# Altium schematic sheet TrainingBoard.SchDoc
size A3
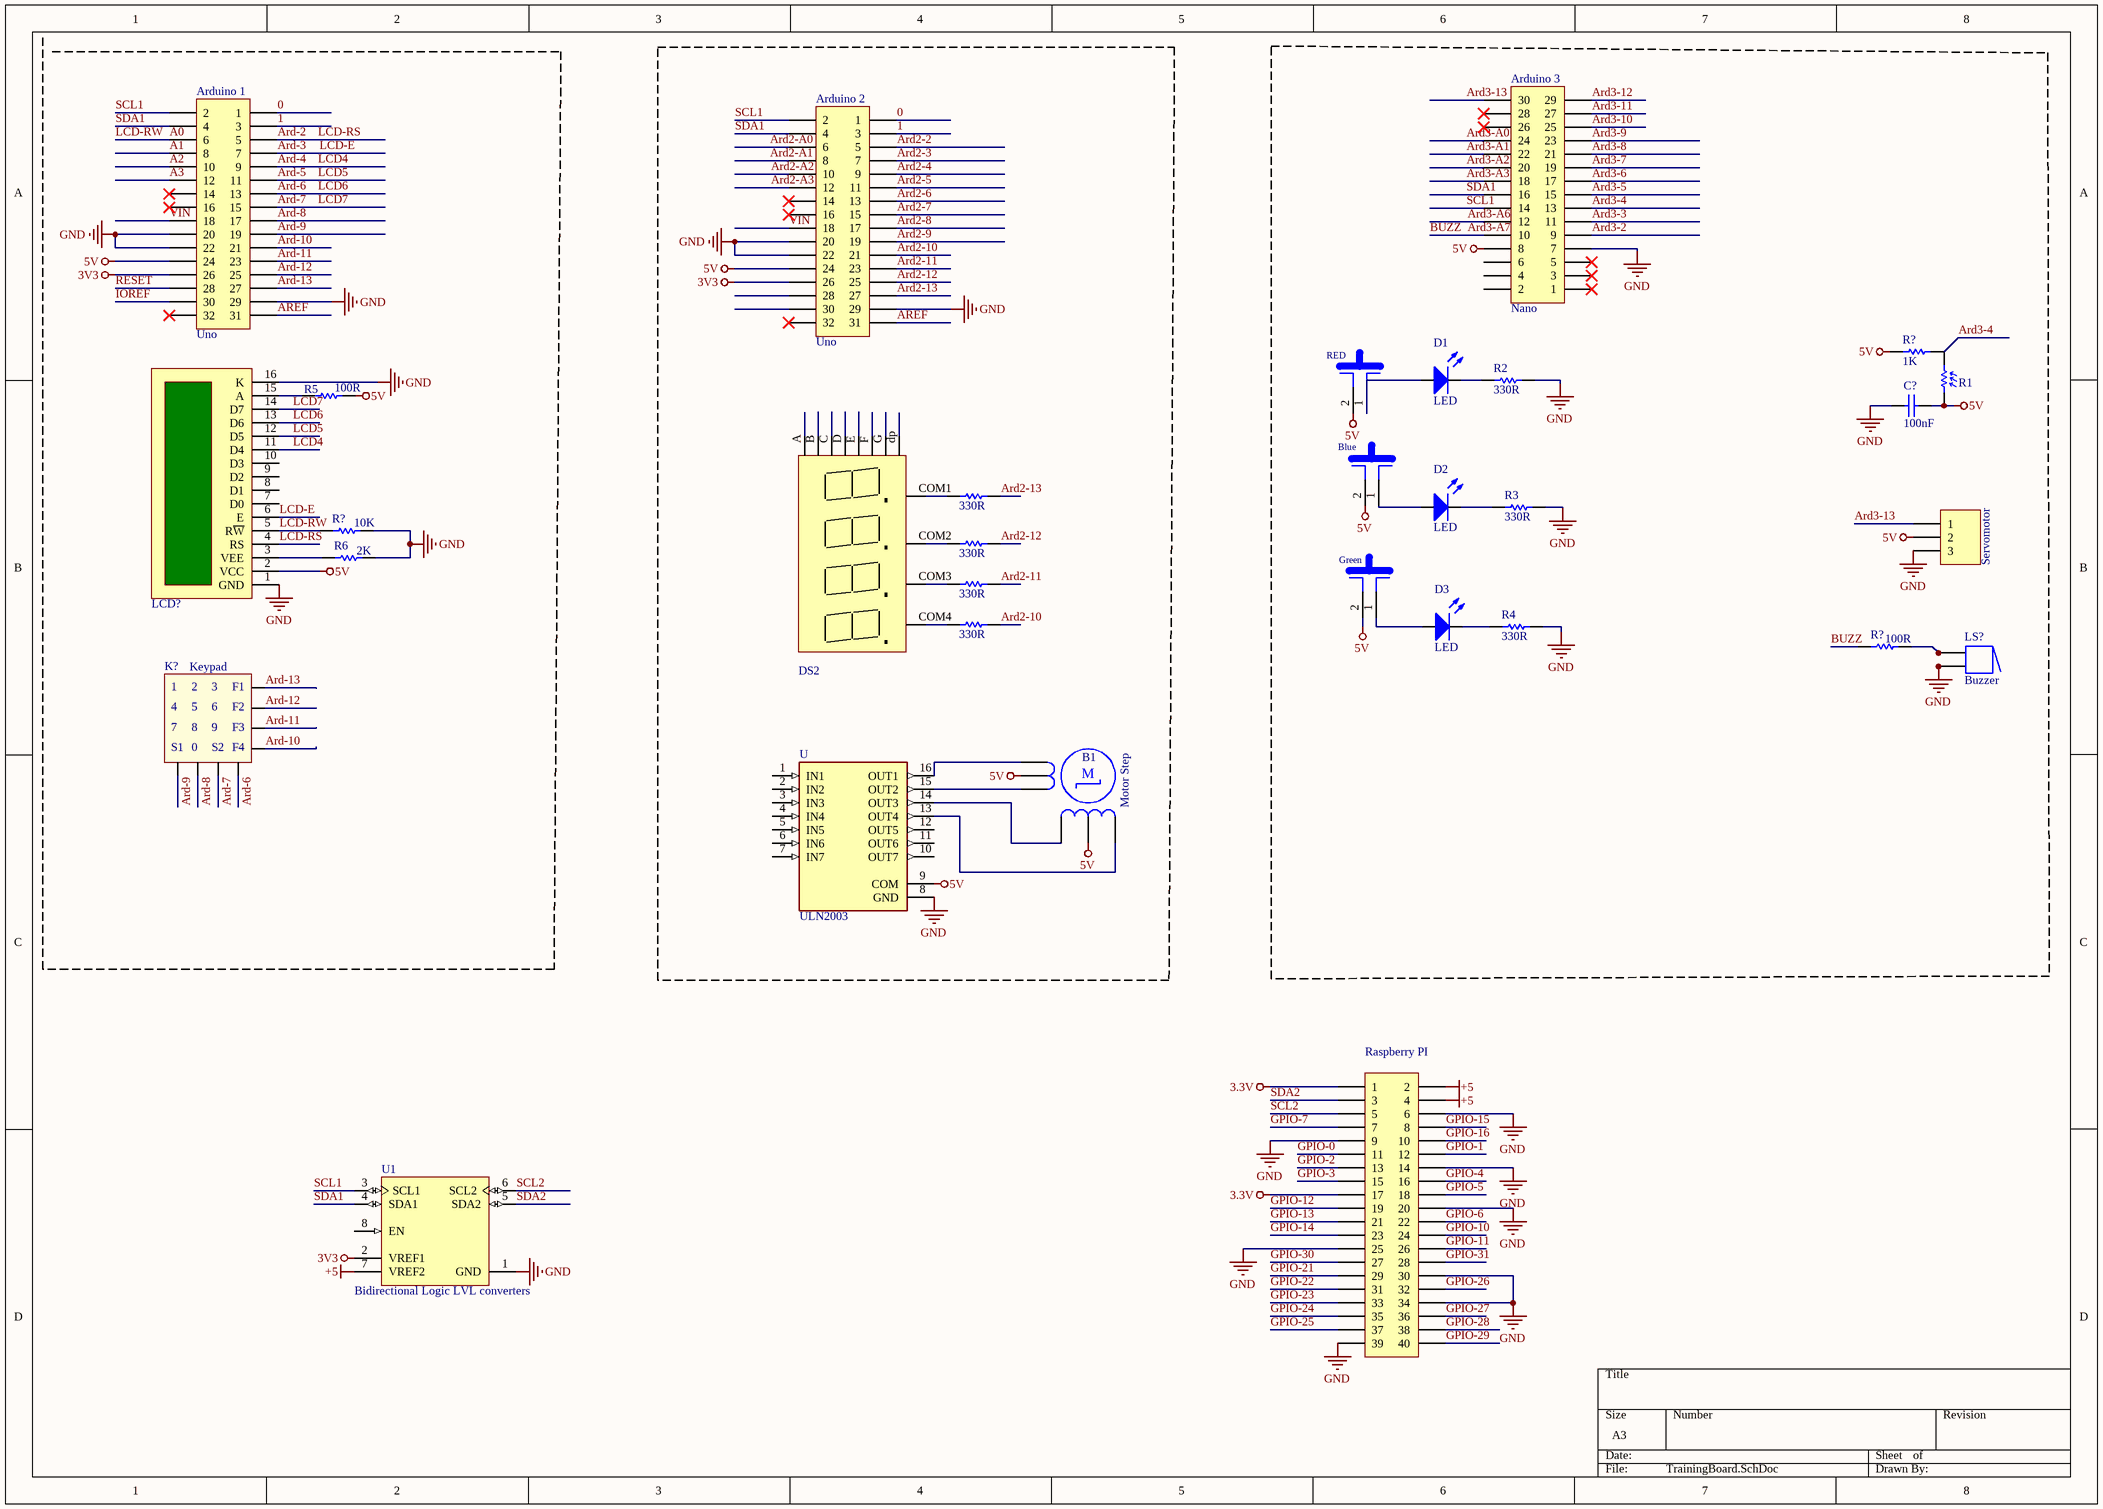
[diagram p0: TrainingBoard.SchDoc]

## Parts
(Parts that share a designator on the sheet are numbered #1, #2 ... from top to bottom, then left to right.)
Arduino_1  Uno  [HDR2X16]
Arduino_2  Uno  [HDR2X16]
Arduino_3  Nano  [HDR2X15]
B1  Motor Step  [DIP-6]
Blue  SWR-41  [Sw_Tact 4pin-big]  (value not drawn)
C?  100nF  [Cap 100nF]
D1  LED  [LED_5mm]
D2  LED  [LED_5mm]
D3  LED  [LED_5mm]
DS2  7SEG-MUX4  [7SEG-mux4]  (value not drawn)
Green  SWR-41  [Sw_Tact 4pin-big]  (value not drawn)
K?  Keypad  [Keypad-4x4]
LCD?  LCD2x16  [LCD 2*16]  (value not drawn)
LS?  Buzzer  [ABSM-1574]
P2  Raspberry PI  [HDR2X20H]
P3  Servomotor  [HDR1X3]
R1  LDR  [LDR_Big]  (value not drawn)
R2  330R  [Axial-0.4-0.25W]
R3  330R  [Axial-0.4-0.25W]
R4  330R  [Axial-0.4-0.25W]
R5  100R  [Axial-0.4-0.25W]
R6  2K  [Axial-0.4-0.25W]
R?#1  1K  [Axial-0.4-0.25W]
R?#2  330R  [Axial-0.4-0.25W]
R?#3  10K  [Axial-0.4-0.25W]
R?#4  330R  [Axial-0.4-0.25W]
R?#5  330R  [Axial-0.4-0.25W]
R?#6  330R  [Axial-0.4-0.25W]
R?#7  100R  [Axial-0.4-0.25W]
RED  SWR-41  [Sw_Tact 4pin-big]  (value not drawn)
U  ULN2003  [DIP762W46P254L1969H533Q16]
U1  Bidirectional Logic LVL converters  [DCT8_N]

## Nets
3.3V: P2.1 P2.17
3V3: Arduino_1.26 Arduino_2.26 U1.2(VREF1)
5V: Arduino_1.24 Arduino_2.24 Arduino_3.8 B1.2 B1.5 Blue.2 C?.1 Green.2 LCD?.2(VCC) P3.2 R1.1 R5.2 R?#1.1 RED.2 U.9(COM)
+5: P2.2 P2.4 U1.7(VREF2)
GND: Arduino_1.20 Arduino_1.22 Arduino_1.29 Arduino_2.20 Arduino_2.22 Arduino_2.29 Arduino_3.7 C?.2 LCD?.1(GND) LCD?.16(K) LS?.2 LS?.2A P2.6 P2.9 P2.14 P2.20 P2.25 P2.30 P2.34 P2.39 P3.3 R2.2 R3.2 R4.2 R6.2 R?#3.2 U.8(GND) U1.1(GND)
0: Arduino_1.1 Arduino_2.1
1: Arduino_1.3 Arduino_2.3
A0: Arduino_1.6 LCD?.5(R~{W}) R?#3.1  [also labelled LCD-RW]
A1: Arduino_1.8
A2: Arduino_1.10
A3: Arduino_1.12
Ard2-2: Arduino_2.5
Ard2-3: Arduino_2.7
Ard2-4: Arduino_2.9
Ard2-5: Arduino_2.11
Ard2-6: Arduino_2.13
Ard2-7: Arduino_2.15
Ard2-8: Arduino_2.17
Ard2-9: Arduino_2.19
Ard2-10: Arduino_2.21 R?#6.2
Ard2-11: Arduino_2.23 R?#5.2
Ard2-12: Arduino_2.25 R?#4.2
Ard2-13: Arduino_2.27 R?#2.2
Ard2-A0: Arduino_2.6
Ard2-A1: Arduino_2.8
Ard2-A2: Arduino_2.10
Ard2-A3: Arduino_2.12
Ard3-2: Arduino_3.9
Ard3-3: Arduino_3.11
Ard3-4: Arduino_3.13
Ard3-5: Arduino_3.15
Ard3-6: Arduino_3.17
Ard3-7: Arduino_3.19
Ard3-8: Arduino_3.21
Ard3-9: Arduino_3.23
Ard3-10: Arduino_3.25
Ard3-11: Arduino_3.27
Ard3-12: Arduino_3.29
Ard3-13: Arduino_3.30 P3.1
Ard3-A0: Arduino_3.24
Ard3-A1: Arduino_3.22
Ard3-A2: Arduino_3.20
Ard3-A3: Arduino_3.18
Ard3-A6: Arduino_3.12
Ard3-A7: Arduino_3.10 R?#7.1  [also labelled BUZZ]
Ard-2: Arduino_1.5 LCD?.4(RS)  [also labelled LCD-RS]
Ard-3: Arduino_1.7 LCD?.6(E)  [also labelled LCD-E]
Ard-4: Arduino_1.9 LCD?.11(D4)  [also labelled LCD4]
Ard-5: Arduino_1.11 LCD?.12(D5)  [also labelled LCD5]
Ard-6: Arduino_1.13 K?.C4 LCD?.13(D6)  [also labelled LCD6]
Ard-7: Arduino_1.15 K?.C3 LCD?.14(D7)  [also labelled LCD7]
Ard-8: Arduino_1.17 K?.C2
Ard-9: Arduino_1.19 K?.C1
Ard-10: Arduino_1.21 K?.R4
Ard-11: Arduino_1.23 K?.R3
Ard-12: Arduino_1.25 K?.R2
Ard-13: Arduino_1.27 K?.R1
AREF: Arduino_1.31 Arduino_2.31
GPIO-0: P2.11
GPIO-1: P2.12
GPIO-2: P2.13
GPIO-3: P2.15
GPIO-4: P2.16
GPIO-5: P2.18
GPIO-6: P2.22
GPIO-7: P2.7
GPIO-10: P2.24
GPIO-11: P2.26
GPIO-12: P2.19
GPIO-13: P2.21
GPIO-14: P2.23
GPIO-15: P2.8
GPIO-16: P2.10
GPIO-21: P2.29
GPIO-22: P2.31
GPIO-23: P2.33
GPIO-24: P2.35
GPIO-25: P2.37
GPIO-26: P2.32
GPIO-27: P2.36
GPIO-28: P2.38
GPIO-29: P2.40
GPIO-30: P2.27
GPIO-31: P2.28
IOREF: Arduino_1.30
RESET: Arduino_1.28
SCL1: Arduino_1.2 Arduino_2.2 Arduino_3.14 U1.3(SCL1)
SCL2: P2.5 U1.6(SCL2)
SDA1: Arduino_1.4 Arduino_2.4 Arduino_3.16 U1.4(SDA1)
SDA2: P2.3 U1.5(SDA2)
VIN: Arduino_1.18 Arduino_2.18
NetB1_1: B1.1 U.16(OUT1)
NetB1_3: B1.3 U.15(OUT2)
NetB1_4: B1.4 U.14(OUT3)
NetB1_6: B1.6 U.13(OUT4)
NetBlue_1: Blue.1 D2.A
NetD1_A: D1.A RED.1
NetD1_K: D1.K R2.1
NetD2_K: D2.K R3.1
NetD3_A: D3.A Green.1
NetD3_K: D3.K R4.1
NetDS2_COM1: DS2.COM1 R?#2.1
NetDS2_COM2: DS2.COM2 R?#4.1
NetDS2_COM3: DS2.COM3 R?#5.1
NetDS2_COM4: DS2.COM4 R?#6.1
NetLCD?_3: LCD?.3(VEE) R6.1
NetLCD?_15: LCD?.15(A) R5.1
NetLS?_1: LS?.1 LS?.1A R?#7.2
NetR1_2: R1.2 R?#1.2

Not connected (* = marked no-connect by the designer): Arduino_1 14* 16* 32*; Arduino_2 14* 16* 28 30 32*; Arduino_3 1* 2 3* 4 5* 6 26* 28*; DS2 A B C D dp E F G; LCD? 7(D0) 8(D1) 9(D2) 10(D3); U 1(IN1) 2(IN2) 3(IN3) 4(IN4) 5(IN5) 6(IN6) 7(IN7) 10(OUT7) 11(OUT6) 12(OUT5); U1 8(EN)

## Notes on the sheet
- (in symbol Keypad4x4) 1; 2; 3; F1; 4; 5; 6; F2; 7; 8; 9; F3; S1; 0; S2; F4
- (in symbol Motor Step) M

## Library data of the parts
Arduino_1 Arduino_2 = Header 16X2: Header, 16-Pin, Dual row; LatestRevisionDate: 17-Jul-2002; LatestRevisionNote: Re-released for DXP Platform.; Publisher: Altium Limited
Arduino_3 = Header 15X2: Header, 15-Pin, Dual row; LatestRevisionDate: 17-Jul-2002; LatestRevisionNote: Re-released for DXP Platform.; Publisher: Altium Limited
B1 = Motor Step: Motor Stepper; Published: 24-Mar-1999; LatestRevisionDate: 17-Jul-2002; LatestRevisionNote: Re-released for DXP Platform.; PackageReference: DIP-6; Publisher: Altium Limited; Code_JEDEC: MO-001-AM
Blue Green RED = SWR-41: Button
C? = Cap 100nF
D1-D3 = LED_5mm: Typical INFRARED GaAs LED
K? = Keypad4x4
LS? = Buzzer: Magnetic Transducer Buzzer; Published: 24-Mar-1999; LatestRevisionDate: 17-Dec-2003; LatestRevisionNote: Schematic revised, PCB Footprint replaced.; DatasheetVersion: 17-Dec-2003; PackageReference: ABSM-1574; Publisher: Altium Limited; PackageDescription: Magnetic Transducer Buzzer; ComponentLink1Description: Manufacturer Link; ComponentLink1URL: http://www.megastar.com/linecard/buzzmode/index.php
P2 = Header 20X2H: Header, 20-Pin, Dual row, Right Angle; LatestRevisionDate: 17-Jul-2002; LatestRevisionNote: Re-released for DXP Platform.; Publisher: Altium Limited
P3 = Header 3: Header, 3-Pin; LatestRevisionDate: 17-Jul-2002; LatestRevisionNote: Re-released for DXP Platform.; Publisher: Altium Limited
R2-R6 R?#1-R?#7 = RES
U = ULN2003: Bipolar _BJT_ Transistor Array 7 NPN Darlington 50V 500mA Surface Mount 16-SO; MF: ON Semiconductor; Package: SOIC-16 ON Semiconductor; Availability: Unavailable; MP: ULN2003; Value: *; SnapEDA_Link: https://www.snapeda.com/parts/ULN2003/ON%20Semiconductor/view-part/4449859/?ref=snap; Price: None
U1 = PCA9306DCTR: Dual Bi-Directional I2C-Bus and SMBus Voltage Level-Translator, 0 to 5.5 V, -40 to 85 degC, 8-pin SM8 (DCT), Green (RoHS & no Sb/Br); Manufacturer: Texas Instruments; SubFamily: I2C Special Function; No. of Outputs: 2; tpd max(ns): 1.5; fSCLK(Max)(MHz): 400; Function: Voltage Translator; Vcc range(V): 0 to 5.5; Enable Pin: Yes; Rating: Catalog; DatasheetVersion: SCPS113J; PackageVersion: revC, Sep-2002; PackageReference: DCT8; PackageDescription: 8-Pin Thin Small Outline Package 3 x 2.8 mm Body ,0.65 mm Pitch; Supplier 1: Digi-Key; Supplier Part Number 1: 296-18509-2-ND; Supplier 2: Digi-Key; Supplier Part Number 2: 296-18509-1-ND; Supplier 3: Digi-Key; Supplier Part Number 3: 296-18509-6-ND; Supplier 4: Farnell; Supplier Part Number 4: 1470936RL; Supplier 5: Farnell; Supplier Part Number 5: 1470936; Supplier 6: Newark; Supplier Part Number 6: 65J6232; Supplier 7: Mouser; Supplier Part Number 7: 595-PCA9306DCTR; Eco-Plan: Green (RoHS & no Sb/Br); Max Frequency(kHz): 400; Open Drain I/O Type: Yes; 5V Tolerant I/O: Yes; On-Chip Power-on-Reset: No; Mounting Technology: Surface Mount; PartNumber: PCA9306DCTR; Code_JEDEC: MO-187-DA; ComponentLink1Description: Datasheet; ComponentLink1URL: http://www.ti.com/general/docs/lit/getliterature.tsp?genericPartNumber=PCA9306&fileType=pdf; ComponentLink2Description: Package Specification; ComponentLink2URL: http://www.ti.com/litv/pdf/mpds049b